# EAGLE design vc_pan (EAGLE 7.2.0)
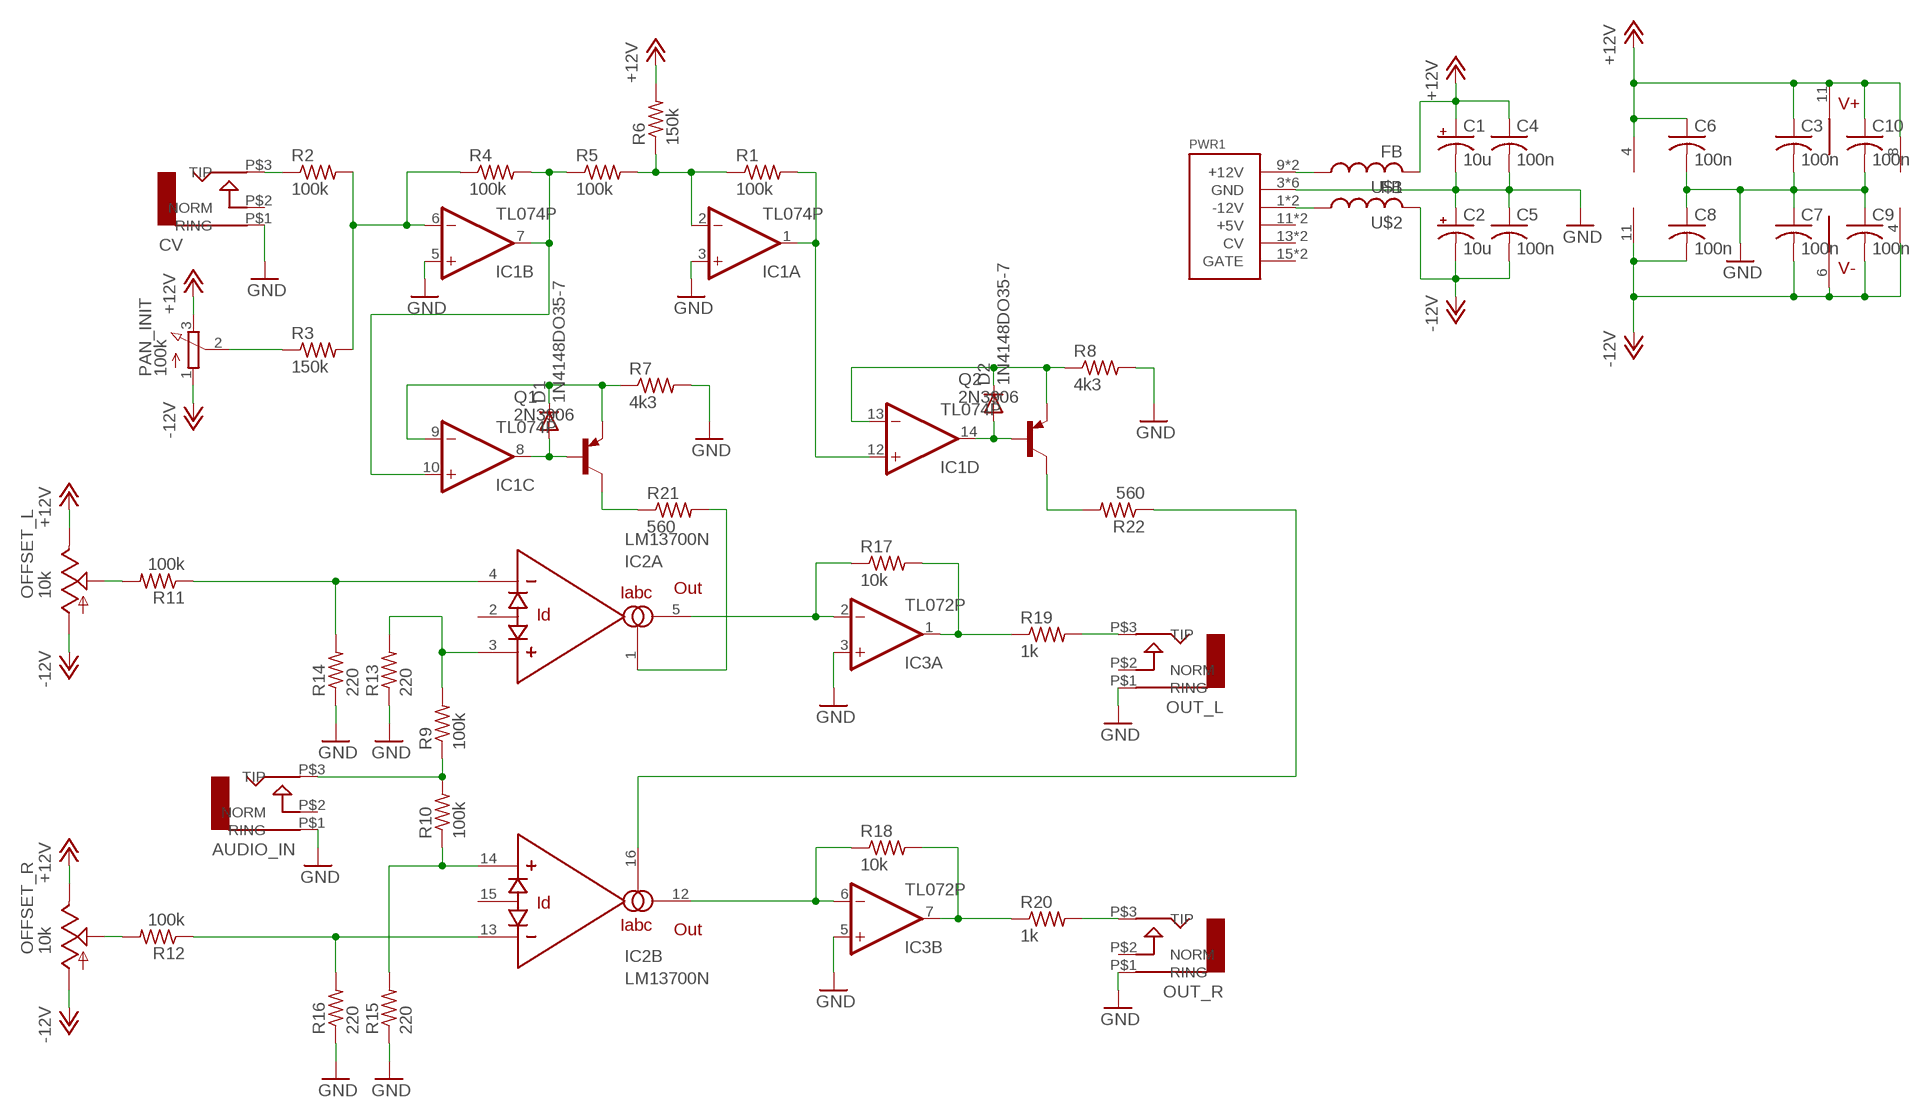
[diagram p0: schematic, sheet 1]

## Parts
AUDIO_IN  AUDIO-JACK  [ERTHENVAR-JACK-90DEG]
C1  10u  CPOL-USB45181A  [B45181A]
C2  10u  CPOL-USB45181A  [B45181A]
C3  100n  C-US050-024X044  [C050-024X044]
C4  100n  C-US050-024X044  [C050-024X044]
C5  100n  C-US050-024X044  [C050-024X044]
C6  100n  C-US050-024X044  [C050-024X044]
C7  100n  C-US050-024X044  [C050-024X044]
C8  100n  C-US050-024X044  [C050-024X044]
C9  100n  C-US050-024X044  [C050-024X044]
C10  100n  C-US050-024X044  [C050-024X044]
CV  AUDIO-JACK  [ERTHENVAR-JACK-90DEG]
D1  1N4148DO35-7  [DO35-7]
D2  1N4148DO35-7  [DO35-7]
IC1  TL074P  [DIL14]
IC2  LM13700N  [DIL16]
IC3  TL072P  [DIL08]
OFFSET_L  10k  TRIM_US-B64Y  [B64Y]
OFFSET_R  10k  TRIM_US-B64Y  [B64Y]
OUT_L  AUDIO-JACK  [ERTHENVAR-JACK-90DEG]
OUT_R  AUDIO-JACK  [ERTHENVAR-JACK-90DEG]
PAN_INIT  100k  3RP/1610N  [3RP/1610N]
PWR1  POWER  [POWER_16]
Q1  2N3906  [TO92]
Q2  2N3906  [TO92]
R1  100k  R-US_0207/10  [0207/10]
R2  100k  R-US_0207/10  [0207/10]
R3  150k  R-US_0207/10  [0207/10]
R4  100k  R-US_0207/10  [0207/10]
R5  100k  R-US_0207/10  [0207/10]
R6  150k  R-US_0207/10  [0207/10]
R7  4k3  R-US_0207/10  [0207/10]
R8  4k3  R-US_0207/10  [0207/10]
R9  100k  R-US_0207/10  [0207/10]
R10  100k  R-US_0207/10  [0207/10]
R11  100k  R-US_0207/10  [0207/10]
R12  100k  R-US_0207/10  [0207/10]
R13  220  R-US_0207/10  [0207/10]
R14  220  R-US_0207/10  [0207/10]
R15  220  R-US_0207/10  [0207/10]
R16  220  R-US_0207/10  [0207/10]
R17  10k  R-US_0207/10  [0207/10]
R18  10k  R-US_0207/10  [0207/10]
R19  1k  R-US_0207/10  [0207/10]
R20  1k  R-US_0207/10  [0207/10]
R21  560  R-US_0207/10  [0207/10]
R22  560  R-US_0207/10  [0207/10]
U$1  FB  [FB]
U$2  FB  [FB]

## Nets
+12V: C1.+ C3.1 C4.1 C6.1 C10.1 IC1.4(P:V+) IC2.11(V+) IC3.8(P:V+) OFFSET_L.E OFFSET_R.E PAN_INIT.3(E) R6.2 U$1.P$2
-12V: C2.- C5.2 C7.2 C8.2 C9.2 IC1.11(P:V-) IC2.6(V-) IC3.4(P:V-) OFFSET_L.A OFFSET_R.A PAN_INIT.1(A) U$2.P$2
GND: AUDIO_IN.P$1(RING) C1.- C2.+ C3.2 C4.2 C5.1 C6.2 C7.1 C8.1 C9.1 C10.2 CV.P$1(RING) IC1.3(A:+IN) IC1.5(B:+IN) IC3.3(A:+IN) IC3.5(B:+IN) OUT_L.P$1(RING) OUT_R.P$1(RING) PWR1.3(GND) PWR1.4(GND) PWR1.5(GND) PWR1.6(GND) PWR1.7(GND) PWR1.8(GND) R7.2 R8.2 R13.1 R14.1 R15.1 R16.1
N$1: PWR1.9(+12V) PWR1.10(+12V) U$1.P$1
N$2: PWR1.1(-12V) PWR1.2(-12V) U$2.P$1
N$3: CV.P$3(TIP) R2.1
N$4: PAN_INIT.2(S) R3.1
N$5: IC1.6(B:-IN) R2.2 R3.2 R4.1
N$6: IC1.7(B:OUT) IC1.10(C:+IN) R4.2 R5.1
N$7: IC1.2(A:-IN) R1.1 R5.2 R6.1
N$8: IC1.1(A:OUT) IC1.12(D:+IN) R1.2
N$9: D1.A IC1.8(C:OUT) Q1.2(B)
N$10: D2.A IC1.14(D:OUT) Q2.2(B)
N$11: D1.C IC1.9(C:-IN) Q1.3(E) R7.1
N$12: D2.C IC1.13(D:-IN) Q2.3(E) R8.1
N$13: AUDIO_IN.P$3(TIP) R9.1 R10.2
N$14: IC2.3(A:+IN) R9.2 R13.2
N$15: IC2.14(B:+IN) R10.1 R15.2
N$16: IC2.4(A:-IN) R11.1 R14.2
N$17: IC2.13(B:-IN) R12.1 R16.2
N$18: OFFSET_R.S R12.2
N$19: OFFSET_L.S R11.2
N$20: IC3.7(B:OUT) R18.2 R20.1
N$21: IC2.5(A:OUT) IC3.2(A:-IN) R17.1
N$22: IC2.12(B:OUT) IC3.6(B:-IN) R18.1
N$23: IC3.1(A:OUT) R17.2 R19.1
N$24: OUT_L.P$3(TIP) R19.2
N$25: OUT_R.P$3(TIP) R20.2
N$28: Q2.1(C) R22.2
N$29: IC2.16(B:IABC) R22.1
N$30: IC2.1(A:IABC) R21.2
N$31: Q1.1(C) R21.1
Unconnected: AUDIO_IN.P$2(NORM) CV.P$2(NORM) IC2.2(A:ID) IC2.7(IN) IC2.8(OUT) IC2.9(OUT) IC2.10(IN) IC2.15(B:ID) OUT_L.P$2(NORM) OUT_R.P$2(NORM) PWR1.11(+5V) PWR1.12(+5V) PWR1.13(CV) PWR1.14(CV) PWR1.15(GATE) PWR1.16(GATE)

## Library data of the parts
AUDIO_IN CV OUT_L OUT_R = erthenvar:AUDIO-JACK: Switching Mono 3.5mm Audio Jack from Erthenvar.
C1 C2 = rcl:CPOL-US: POLARIZED CAPACITOR, American symbol
C3-C10 = rcl:C-US: CAPACITOR, American symbol
D1 D2 = diode:1N4148: DIODE high speed (Philips)
IC1 = linear:TL074: OP AMP
IC2 = synthdiy updated imperial:LM13700: National Dual OTA with buffers.
IC3 = linear:TL072: OP AMP
OFFSET_L OFFSET_R = pot:TRIM_US-: POTENTIOMETER
PAN_INIT = pot:3RP/1610N: 16mm Potentiometer one level Source: http://www.alphapotentiometers.net/html/16mm_pot_2.html
PWR1 = eurorack:POWER
Q1 Q2 = transistor-pnp:2N3906: PNP Transistor
R1-R22 = rcl:R-US_: RESISTOR, American symbol
U$1 U$2 = adafruit:FB: Ferrite bead Digikey #P9821BK-ND

## Board
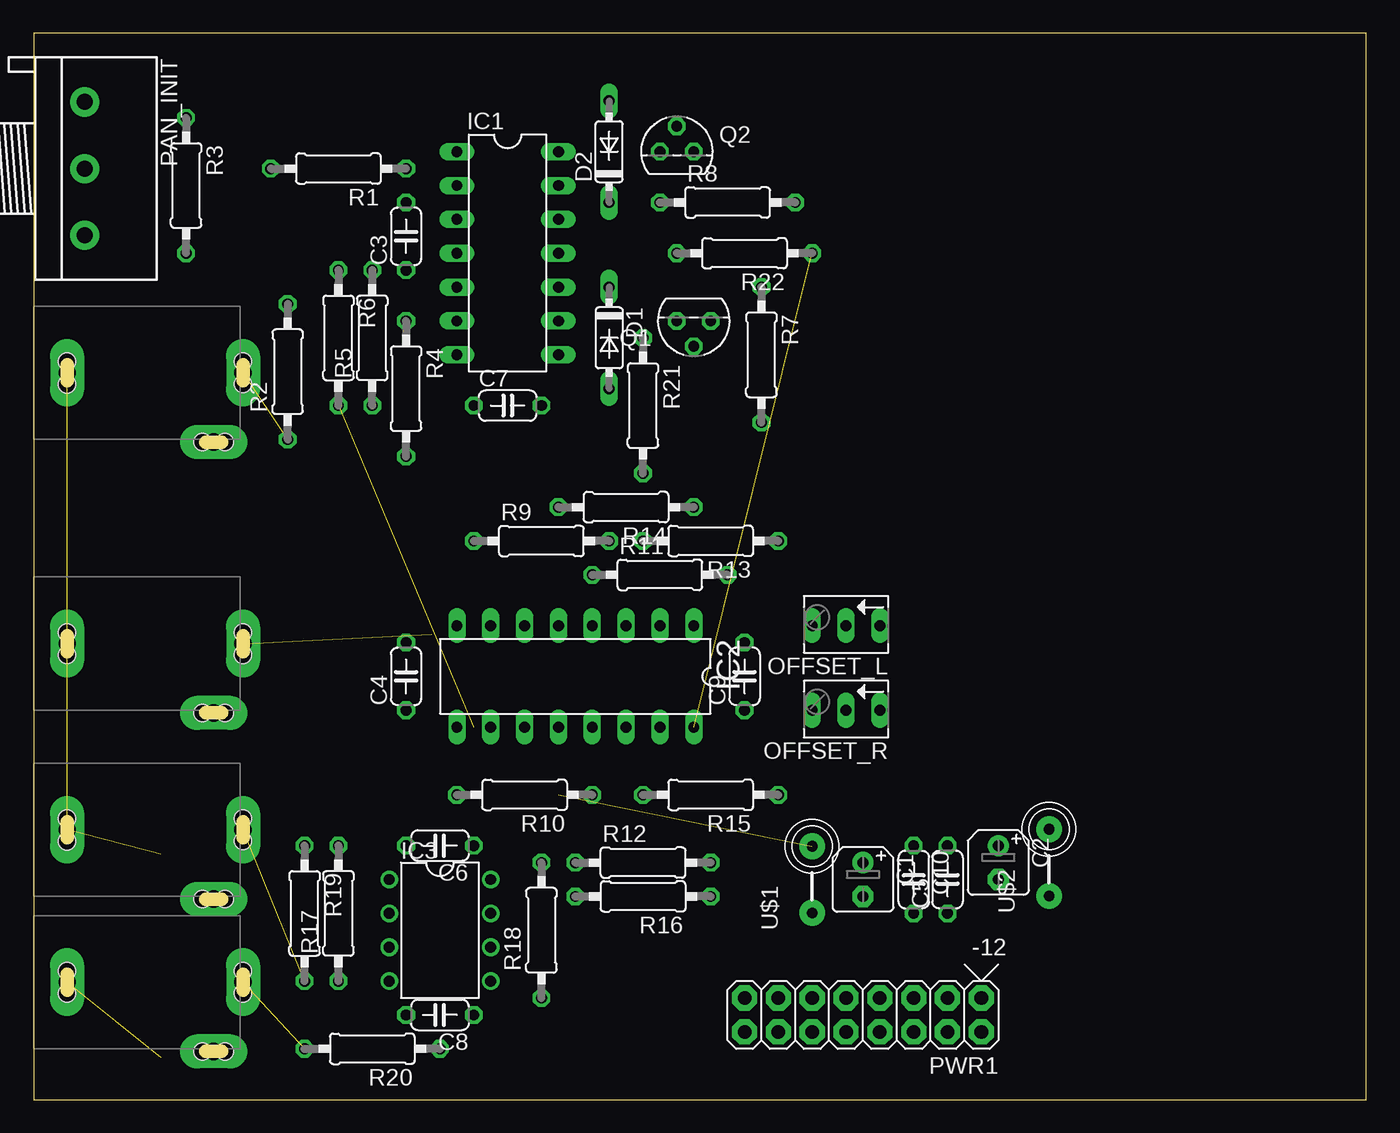
[diagram p1: board, top side]
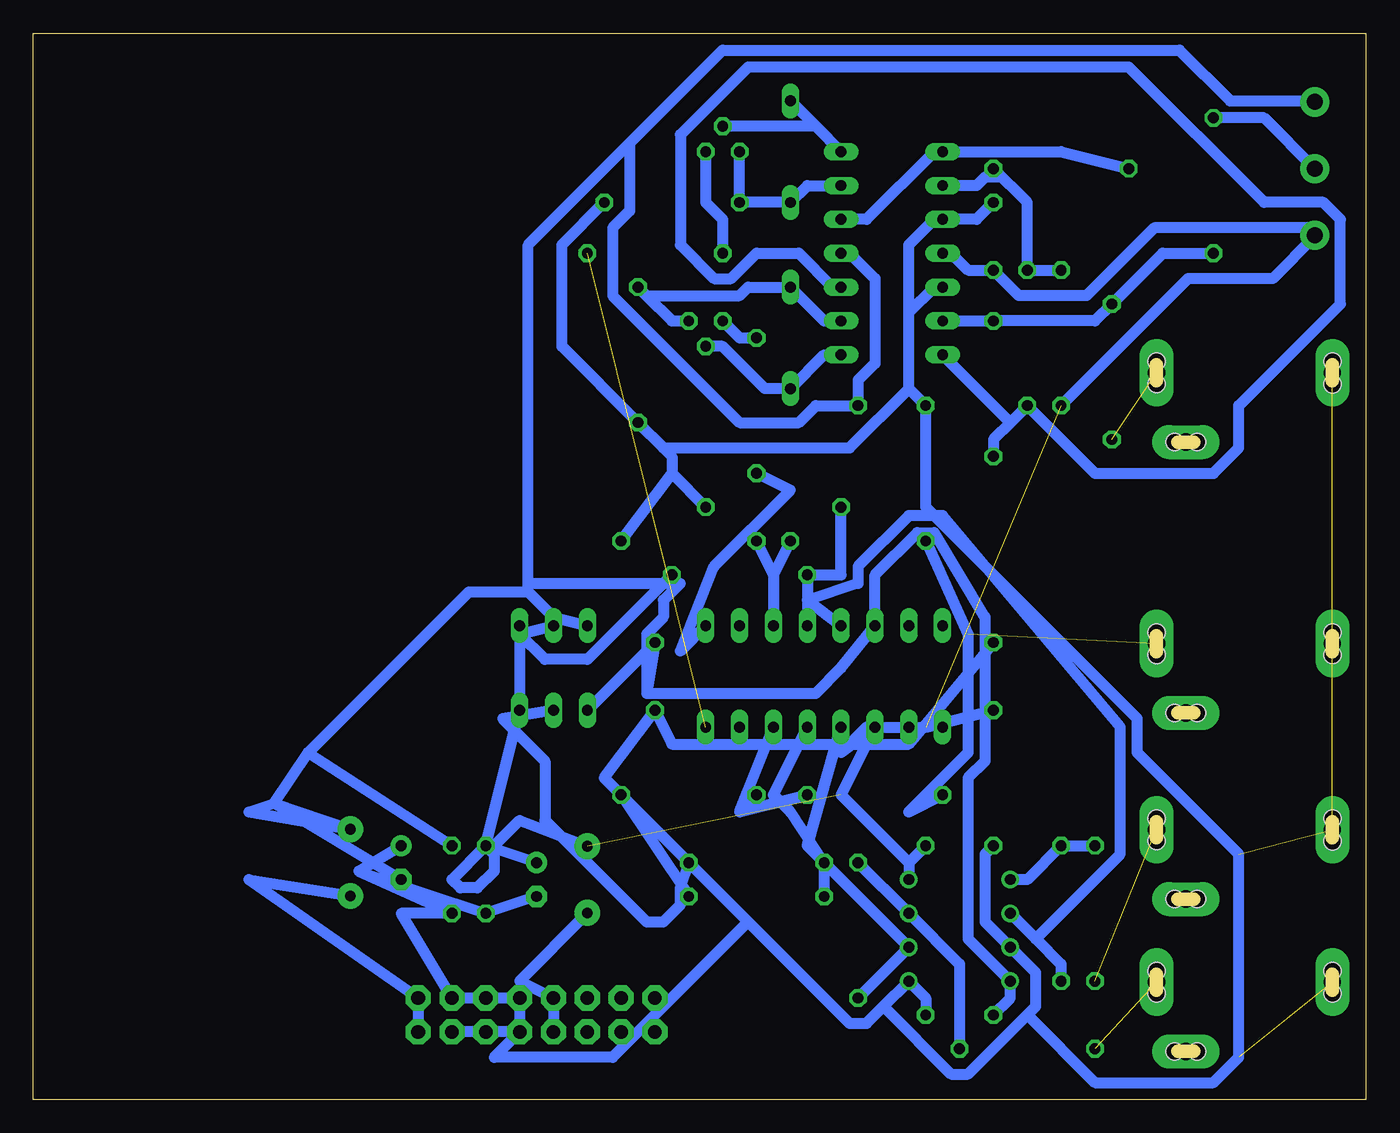
[diagram p2: board, bottom side, seen from below]

Size 100 x 80 mm. Coordinates in mm from the lower left corner, seen from the top.
Outline: 0,0 100,0 100,80 0,80 0,0
Copper layers (1*16): Top 0.035mm / dielectric 1.5mm / Bottom 0.035mm
Design rules "default *": minimum track width 32mil, minimum drill 31mil, track to track 16mil, track to pad 16mil, pad to pad 16mil, via to via 16mil, smd to smd 8mil, copper to edge 0mil, drill to drill 16mil, minimum pad ring 10mil, minimum via ring 8mil, stop-mask expansion 4mil, vias tented up to drill 0mil, thermal gap 10mil

### Footprints (pad centres in the part's own frame; a part is rotated, then mirrored left to right if it is on the bottom)
ERTHENVAR-JACK-90DEG = drill 1.3 pad 2.54 long: P$1 5,-2.5; P$2 -0.2,-13.5; P$3 5,-15.7 | hole 1.3: 5.842,-2.489; 4.14,-2.489; -0.203,-12.649; -0.203,-14.351; 5.842,-15.697; 4.166,-15.697
B45181A = drill 0.813 pad 1.6: + -1.27,0 | drill 0.813 pad 1.6 octagon: - 1.27,0
C050-024X044 = drill 0.813 octagon: 1 -2.54,0; 2 2.54,0
DO35-7 = drill 0.813 long: A 3.81,0; C -3.81,0
DIL14 = drill 0.813 long: 1 -7.62,-3.81; 2 -5.08,-3.81; 3 -2.54,-3.81; 4 0,-3.81; 5 2.54,-3.81; 6 5.08,-3.81; 7 7.62,-3.81; 8 7.62,3.81; 9 5.08,3.81; 10 2.54,3.81; 11 0,3.81; 12 -2.54,3.81; 13 -5.08,3.81; 14 -7.62,3.81
DIL16 = drill 0.813 long: 1 -8.89,-3.81; 2 -6.35,-3.81; 3 -3.81,-3.81; 4 -1.27,-3.81; 5 1.27,-3.81; 6 3.81,-3.81; 7 6.35,-3.81; 8 8.89,-3.81; 9 8.89,3.81; 10 6.35,3.81; 11 3.81,3.81; 12 1.27,3.81; 13 -1.27,3.81; 14 -3.81,3.81; 15 -6.35,3.81; 16 -8.89,3.81
DIL08 = drill 0.813 pad 1.27: 1 -3.81,-3.81; 2 -1.27,-3.81; 3 1.27,-3.81; 4 3.81,-3.81; 5 3.81,3.81; 6 1.27,3.81; 7 -1.27,3.81; 8 -3.81,3.81
B64Y = drill 0.813 long: A 2.54,0; E -2.54,0; S 0,0
3RP/1610N = drill 1.2 pad 2.184: 1 -5,0; 2 0,0; 3 5,0
POWER_16 = drill 1.016 pad 1.88 octagon: 1 -6.35,-1.27; 2 -6.35,1.27; 3 -3.81,-1.27; 4 -3.81,1.27; 5 -1.27,-1.27; 6 -1.27,1.27; 7 1.27,-1.27; 8 1.27,1.27; 9 3.81,-1.27; 10 3.81,1.27; 11 6.35,-1.27; 12 6.35,1.27; 13 8.89,-1.27; 14 8.89,1.27; 15 11.43,-1.27; 16 11.43,1.27
TO92 = drill 0.813 octagon: 1 1.27,0; 2 0,1.905; 3 -1.27,0
0207/10 = drill 0.813 octagon: 1 -5.08,0; 2 5.08,0
FB = drill 0.8 pad 1.93: P$1 -2.5,0; P$2 2.5,0

### Placement (x,y rotation side)
AUDIO_IN  0,29.21 90 top
C1  62.23,16.51 270 top
C2  72.39,17.78 270 top
C3  27.94,64.77 90 top
C4  27.94,31.75 90 top
C5  68.58,16.51 90 top
C6  30.48,19.05 180 top
C7  35.56,52.07 0 top
C8  30.48,6.35 180 top
C9  53.34,31.75 90 top
C10  66.04,16.51 270 top
CV  0,49.53 90 top
D1  43.18,57.15 270 top
D2  43.18,71.12 90 top
IC1  35.56,63.5 270 top
IC2  40.64,31.75 180 top
IC3  30.48,12.7 270 top
OFFSET_L  60.96,35.56 180 top
OFFSET_R  60.96,29.21 180 top
OUT_L  0,15.24 90 top
OUT_R  0,3.81 90 top
PAN_INIT  3.81,69.85 270 top
PWR1  64.77,6.35 180 top
Q1  49.53,58.42 180 top
Q2  48.26,71.12 0 top
R1  22.86,69.85 180 top
R2  19.05,54.61 90 top
R3  11.43,68.58 270 top
R4  27.94,53.34 270 top
R5  25.4,57.15 90 top
R6  22.86,57.15 270 top
R7  54.61,55.88 270 top
R8  52.07,67.31 0 top
R9  38.1,41.91 0 top
R10  36.83,22.86 180 top
R11  46.99,39.37 0 top
R12  45.72,17.78 0 top
R13  50.8,41.91 180 top
R14  44.45,44.45 180 top
R15  50.8,22.86 180 top
R16  45.72,15.24 180 top
R17  22.86,13.97 90 top
R18  38.1,12.7 90 top
R19  20.32,13.97 270 top
R20  25.4,3.81 180 top
R21  45.72,52.07 270 top
R22  53.34,63.5 180 top
U$1  58.42,16.51 90 top
U$2  76.2,17.78 90 top

### Tracks (layer width: path | path; a pad name or v marks a point on that pad's centre or on a via)
+12V  (2 unrouted)
  Bottom 0.813: OFFSET_L.E OFFSET_R.E C10.1 | C10.1 68.58,16.51 67.94,15.88 66.67,15.88 65.41,17.14 65.41,18.41 C10.1 | C1.+ C10.1 | C10.1 65.41,19.05 63.5,20.95 U$1.P$2 | 34.29,17.78 IC3.8 | C6.1 34.29,17.78 | C4.1 33.02,27.94 37.47,27.94 39.37,26.04 IC2.11 39.37,22.86 34.29,17.78 | IC1.4 31.11,63.5 29.84,62.23 C3.1 26.04,60.33 20.95,60.33 15.88,65.41 3.81,65.41 PAN_INIT.3 3.81,64.77 6.99,61.59 13.34,61.59 R6.2
-12V
  Bottom 0.813: C8.2 26.67,7.62 IC3.4 29.84,12.06 29.84,24.13 28.57,25.4 28.57,36.2 32.38,42.55 33.66,42.55 36.83,39.37 IC2.6 39.37,32.38 41.27,30.48 53.98,30.48 | OFFSET_R.A C9.2 53.98,30.48 | IC1.11 38.73,63.5 36.83,61.59 36.83,55.24 38.1,53.98 C7.2 41.27,52.07 42.55,50.8 46.99,50.8 56.52,60.33 56.52,65.41 55.24,66.67 55.24,71.75 | OFFSET_L.A 60.96,36.2 62.87,38.1 | 62.87,38.1 67.31,38.1 79.38,26.04 | 81.92,22.23 83.82,21.59 U$2.P$2 81.92,22.23 | 81.92,22.23 79.38,26.04 | 79.38,26.04 C5.2 | 81.92,22.23 C2.- | 55.24,71.75 62.87,64.14 62.87,38.73 | 55.24,71.75 48.26,78.74 13.97,78.74 10.16,74.93 3.81,74.93 PAN_INIT.1 | 62.87,38.1 62.87,38.73 | 53.98,30.48 53.98,34.92 52.7,36.2 52.7,37.47 51.44,38.73 62.87,38.73
GND  (4 unrouted)
  Bottom 0.813: C3.2 29.21,66.04 IC1.3 32.38,66.04 34.29,64.14 34.29,59.05 | IC1.5 32.38,60.96 34.29,59.05 | 34.29,53.34 34.29,59.05 | 34.29,53.34 C7.1 33.02,44.45 17.14,28.57 17.14,26.04 9.53,18.41 9.53,3.17 11.43,1.27 20.32,1.27 25.4,6.35 | 52.07,46.99 52.07,48.26 52.7,48.9 | 52.07,46.99 R14.1 | 52.7,48.9 R7.2 60.33,56.52 60.33,64.14 R8.2 | 52.07,46.99 R13.1 | 34.29,53.34 38.73,48.9 52.7,48.9 | PWR1.8 PWR1.7 PWR1.5 PWR1.3 72.39,13.97 C5.1 75.56,17.14 | PWR1.8 PWR1.6 PWR1.4 | C1.- C10.2 75.56,17.14 | C2.+ 75.56,17.14 | C6.2 28.57,18.41 28.57,13.34 IC3.3 24.77,9.53 24.77,6.99 25.4,6.35 | C8.1 33.02,7.62 IC3.5 36.2,6.99 | R15.1 R16.1 | R15.1 57.15,24.13 C9.1 52.07,26.67 34.29,26.67 C4.2 | 36.2,6.99 37.47,5.71 38.73,5.71 46.35,13.34 | R15.1 46.35,13.34 | 25.4,6.35 29.84,1.91 31.11,1.91 36.2,6.99 | PWR1.8 65.41,3.17 56.52,3.17 46.35,13.34
N$1
  Bottom 0.813: PWR1.10 PWR1.9 63.5,8.89 U$1.P$1
N$2
  Bottom 0.813: PWR1.2 PWR1.1 83.82,16.51 U$2.P$1
N$3  (1 unrouted)
N$4
  Bottom 0.813: R3.1 7.62,73.66 PAN_INIT.2
N$5
  Bottom 0.813: IC1.6 R4.1 20.32,58.42 R2.2 15.24,63.5 R3.2
N$6
  Bottom 0.813: R4.2 27.94,49.53 26.67,50.8 | 26.67,50.8 R5.1 20.32,46.99 11.43,46.99 9.53,48.9 9.53,52.07 1.91,59.69 1.91,66.04 3.17,67.31 7.62,67.31 17.78,77.47 46.35,77.47 51.44,72.39 51.44,64.14 48.9,61.59 47.62,61.59 45.72,63.5 42.55,63.5 40.01,60.96 IC1.10 | 26.67,50.8 IC1.7
N$7
  Bottom 0.813: R6.1 R5.2 25.4,67.31 R1.1 27.3,69.22 28.57,69.22 29.21,68.58 IC1.2
N$8
  Bottom 0.813: R1.2 22.86,71.12 IC1.1 32.38,71.12 37.47,66.04 IC1.12
N$9
  Bottom 0.813: IC1.8 40.64,55.88 D1.A 45.09,53.34 48.26,56.52 Q1.2
N$10
  Bottom 0.813: D2.A 41.27,73.03 | 41.27,73.03 IC1.14 | 41.27,73.03 Q2.2
N$11
  Bottom 0.813: IC1.9 40.64,58.42 D1.C 46.35,60.96 46.99,60.33 53.98,60.33 | Q1.3 52.07,58.42 53.98,60.33 | R7.1 53.98,60.33
N$12
  Bottom 0.813: IC1.13 41.91,68.58 D2.C R8.1 Q2.3
N$13  (1 unrouted)
  Bottom 0.813: R10.2 34.29,21.59 29.84,26.04 29.84,34.92 R9.1
N$14
  Bottom 0.813: 44.45,39.37 IC2.3 | R9.2 44.45,39.37 | 44.45,39.37 R13.2
N$15
  Bottom 0.813: R15.2 46.99,21.59 | 46.99,21.59 R10.1 | 46.99,21.59 IC2.14
N$16
  Bottom 0.813: IC2.4 R11.1 39.37,39.37 R14.2
N$17
  Bottom 0.813: R16.2 R12.1 43.18,21.59 44.45,22.86 IC2.13
N$18
  Bottom 0.813: R12.2 51.44,15.88 51.44,14.61 52.7,13.34 53.98,13.34 61.59,20.95 61.59,25.4 64.77,28.57 OFFSET_R.S
N$19
  Bottom 0.813: OFFSET_L.S 63.5,34.92 61.59,33.02 58.42,33.02 R11.2
N$20
  Bottom 0.813: R20.1 30.48,10.16 IC3.7 R18.2
N$21
  Bottom 0.813: R17.1 22.86,10.16 24.77,12.06 | IC3.2 24.77,12.06 | IC2.5 41.91,37.47 38.1,38.73 38.1,40.01 34.29,43.81 31.75,43.81 18.41,27.94 18.41,18.41 24.77,12.06
N$22
  Bottom 0.813: R18.1 IC3.6 41.91,19.05 IC2.12
N$23
  Bottom 0.813: R19.1 R17.2 25.4,16.51 IC3.1
N$24  (1 unrouted)
N$25  (1 unrouted)
N$28
  Bottom 0.813: R22.2 48.26,66.04 49.53,67.31 Q2.1
N$29  (1 unrouted)
N$30
  Bottom 0.813: R21.2 43.18,45.72 48.9,40.01 51.44,33.66 IC2.1
N$31
  Bottom 0.813: R21.1 46.99,57.15 Q1.1